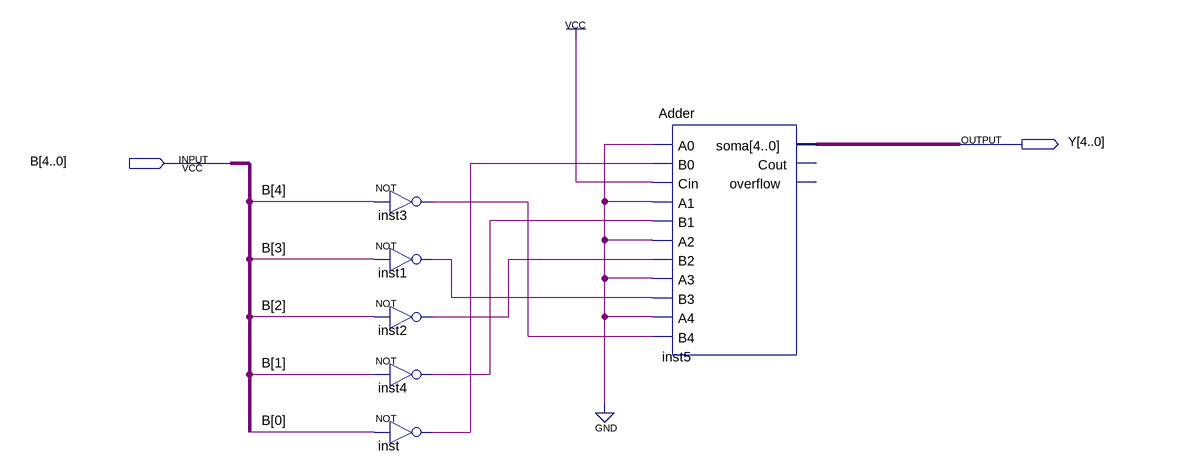
[diagram p0: schematic sheet]
// Quartus schematic Inverter.bdf as structural Verilog: 6 symbols, 2 pins
module Inverter (
  input  [4:0] B,
  output [4:0] Y
);

  wire inst1_out, inst2_out, inst3_out, inst4_out, inst_out;

  not inst3 (inst3_out, B[4]);
  not inst1 (inst1_out, B[3]);
  not inst2 (inst2_out, B[2]);
  not inst4 (inst4_out, B[1]);
  not inst (inst_out, B[0]);
  Adder inst5 (
    .A0(1'b0), .B0(inst_out), .Cin(1'b1), .A1(1'b0), .B1(inst4_out), .A2(1'b0), .B2(inst2_out), .A3(1'b0),
    .B3(inst1_out), .A4(1'b0), .B4(inst3_out), .soma(Y));  // open: Cout, overflow
endmodule
